# EAGLE design esquema v4 (EAGLE 9.6.2)
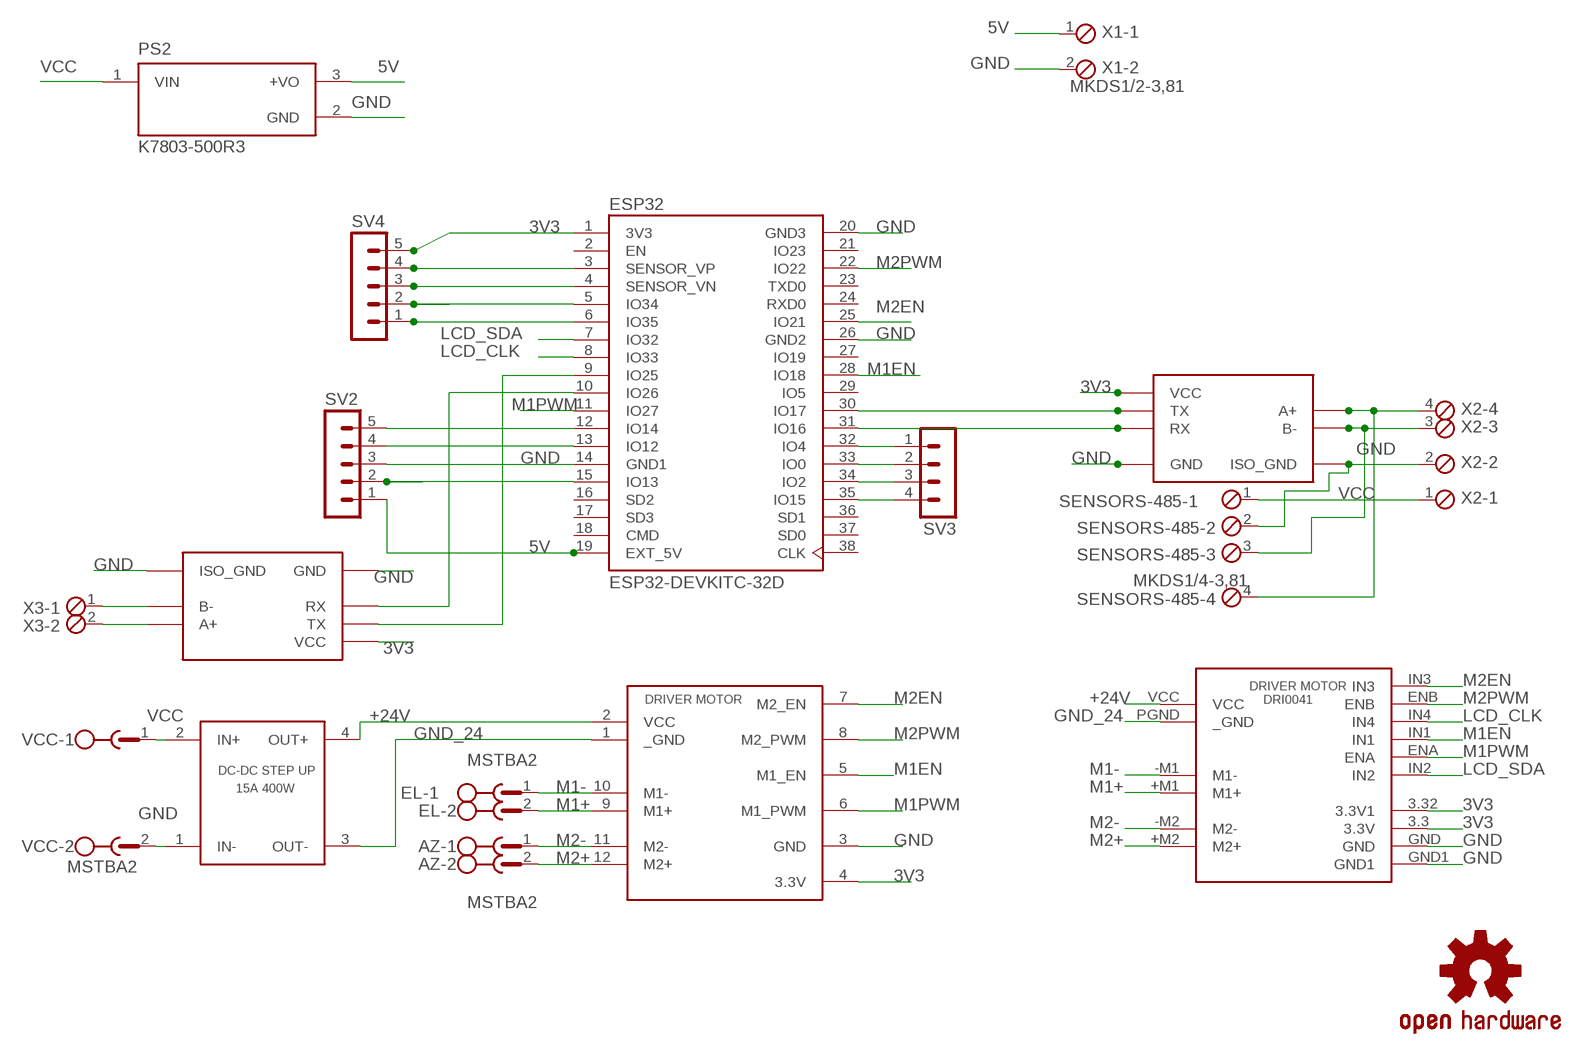
[diagram p0: schematic, sheet 1]

## Parts
AZ  MSTBA2  [MSTBA2]
EL  MSTBA2  [MSTBA2]
ESP32  ESP32-DEVKITC-32D  [MODULE_ESP32-DEVKITC-32D]
LOGO1  OSHW-LOGOMINI  [OSHW-LOGO-MINI]
M1  DRIVER_MOTOR  [DRIVER_MOTOR]
M2  DC-DC_STRP_UP  [DC-DC-SETP-UP]
M3  LIMNOTECH_SMC_RS485  [LIMNOTECH_SMC_RS485]
M4  LIMNOTECH_SMC_RS485  [LIMNOTECH_SMC_RS485]
PS2  K7803-500R3  [CONV_K7803-500R3]
SENSORS-485  MKDS1/4-3,81  [4POL381]
SV2  MA05-1  [MA05-1]
SV3  MA04-1  [MA04-1]
SV4  MA05-1  [MA05-1]
U$2  DRIVER_DRI0041  [DRI0041]
VCC  MSTBA2  [MSTBA2]
X1  MKDS1/2-3,81  [2POL381]
X2  MKDS1/4-3,81  [4POL381]
X3  MKDS1/2-3,81  [2POL381]

## Nets
3V3: ESP32.1(3V3) M1.4(3.3V) M3.VCC M4.VCC SV4.5 U$2.3.3(3.3V) U$2.3.32(3.3V1)
5V: ESP32.19(EXT_5V) PS2.3(+VO) SV2.1 X1.1
+24V: M1.2(VCC) M2.4(OUT+) U$2.VCC
GND: ESP32.14(GND1) ESP32.20(GND3) ESP32.26(GND2) M1.3(GND) M2.1(IN-) M3.GND M3.GND_ISO(ISO_GND) M4.GND M4.GND_ISO(ISO_GND) PS2.2(GND) SENSORS-485.2 SV2.3 U$2.GND U$2.GND1 VCC.2 X1.2 X2.2
GND_24: M1.1(_GND) M2.3(OUT-) U$2.PGND(_GND)
LCD_CLK: ESP32.8(IO33) U$2.IN4
LCD_SDA: ESP32.7(IO32) U$2.IN2
M1+: EL.2 M1.9(M1+) U$2.+M1(M1+)
M1-: EL.1 M1.10(M1-) U$2.-M1(M1-)
M1EN: ESP32.28(IO18) M1.5(M1_EN) U$2.IN1
M1PWM: ESP32.11(IO27) M1.6(M1_PWM) U$2.ENA
M2+: AZ.2 M1.12(M2+) U$2.+M2(M2+)
M2-: AZ.1 M1.11(M2-) U$2.-M2(M2-)
M2EN: ESP32.25(IO21) M1.7(M2_EN) U$2.IN3
M2PWM: ESP32.22(IO22) M1.8(M2_PWM) U$2.ENB
N$1: M4.B- SENSORS-485.3 X2.3
N$2: M4.A+ SENSORS-485.4 X2.4
N$3: ESP32.3(SENSOR_VP) SV4.4
N$4: ESP32.4(SENSOR_VN) SV4.3
N$5: ESP32.10(IO26) M3.RX
N$6: ESP32.9(IO25) M3.TX
N$7: ESP32.31(IO16) M4.RX
N$8: ESP32.30(IO17) M4.TX
N$9: M3.B- X3.1
N$10: M3.A+ X3.2
N$11: ESP32.5(IO34) SV4.2
N$12: ESP32.6(IO35) SV4.1
N$13: ESP32.15(IO13) SV2.2
N$18: ESP32.13(IO12) SV2.4
N$19: ESP32.12(IO14) SV2.5
N$20: ESP32.32(IO4) SV3.1
N$21: ESP32.33(IO0) SV3.2
N$22: ESP32.34(IO2) SV3.3
N$23: ESP32.35(IO15) SV3.4
VCC [power]: M2.2(IN+) PS2.1(VIN) SENSORS-485.1 VCC.1 X2.1
Unconnected: ESP32.2(EN) ESP32.16(SD2) ESP32.17(SD3) ESP32.18(CMD) ESP32.21(IO23) ESP32.23(TXD0) ESP32.24(RXD0) ESP32.27(IO19) ESP32.29(IO5) ESP32.36(SD1) ESP32.37(SD0) ESP32.38(CLK)

## Library data of the parts
AZ EL VCC = con-phoenix-508:MSTBA2: PHOENIX; MF: FARNELL; MPN: 1757242; OC_FARNELL: 3705171; OC_NEWARK: 71C4161
ESP32 = ESP32-DEVKITC-32D:ESP32-DEVKITC-32D: Eval Board For Esp-Wroom-32 Check prices <https://pricing.snapeda.com/parts/ESP32-DEVKITC-32D/Espressif%20Systems/view-part?ref=eda>; AVAILABILITY: Warning; DESCRIPTION: EVAL BOARD FOR ESP-WROOM-32; MF: Espressif Systems; MP: ESP32-DEVKITC-32D; PACKAGE: None; PRICE: None; PURCHASE-URL: https://pricing.snapeda.com/search/part/ESP32-DEVKITC-32D/?ref=eda
LOGO1 = SparkFun-Aesthetics:OSHW-LOGO: Open-Source Hardware (OSHW) Logo This logo indicates the piece of hardware it is found on incorporates a OSHW license and/or adheres to the definition of open source hardware found here: http://freedomdefined.org/OSHW
M1 = aamilibreria:DRIVER_MOTOR
M2 = aamilibreria:DC-DC_STRP_UP
M3 M4 = aamilibreria:LIMNOTECH_SMC_RS485: Layout for connecting SMC RS-485 module Module <https://www.amazon.com/SMAKN%C2%AE-Adapter-Serial-Converter-Module/dp/B010723BCE>
PS2 = K7803-500R3:K7803-500R3: DC/DC Converter Check availability <https://pricing.snapeda.com/parts/K7803-500R3/Mornsun%20America%2C%20LLC/view-part?ref=eda>; AVAILABILITY: In Stock; DESCRIPTION: Non-Isolated PoL Module DC DC Converter 1 Output 3.3V, -3.3V - - - 500mA, 300mA 4.75V, 7V - 36V, 32V Input; MF: Mornsun America, LLC; MP: K7803-500R3; PACKAGE: SIP-3-3 MORNSUN; PRICE: None; PURCHASE-URL: https://pricing.snapeda.com/search/part/K7803-500R3/?ref=eda
SENSORS-485 X2 = con-phoenix-381:MKDS1/4-3,81: MKDS 1/4-3,81 - Order No. 1727036 Pitch: 3,81mm Number of terminals: 4 Rated Voltage: 160V Maximum load current/ cross section: 12A/1.5mm2-AWG16 Housing Interlocking: none Color: Green
SV2 SV4 = con-lstb:MA05-1: PIN HEADER; OC_FARNELL: unknown; OC_NEWARK: unknown
SV3 = con-lstb:MA04-1: PIN HEADER; OC_FARNELL: unknown; OC_NEWARK: unknown
U$2 = aamilibreria:DRIVER_DRI0041
X1 X3 = con-phoenix-381:MKDS1/2-3,81: MKDS 1/2-3,81 - Order No. 1727010 (RS-Online - 101-5384) Pitch: 3,81mm Number of terminals: 2 Rated Voltage: 160V Maximum load current/ cross section: 12A/1.5mm2-AWG16 Housing Interlocking: none Color: Green

## Net classes
0 default: width 0.5 mm, drill 0.5 mm, clearance 0.8 mm
1 power: width 0.8 mm, clearance 1 mm

## Board
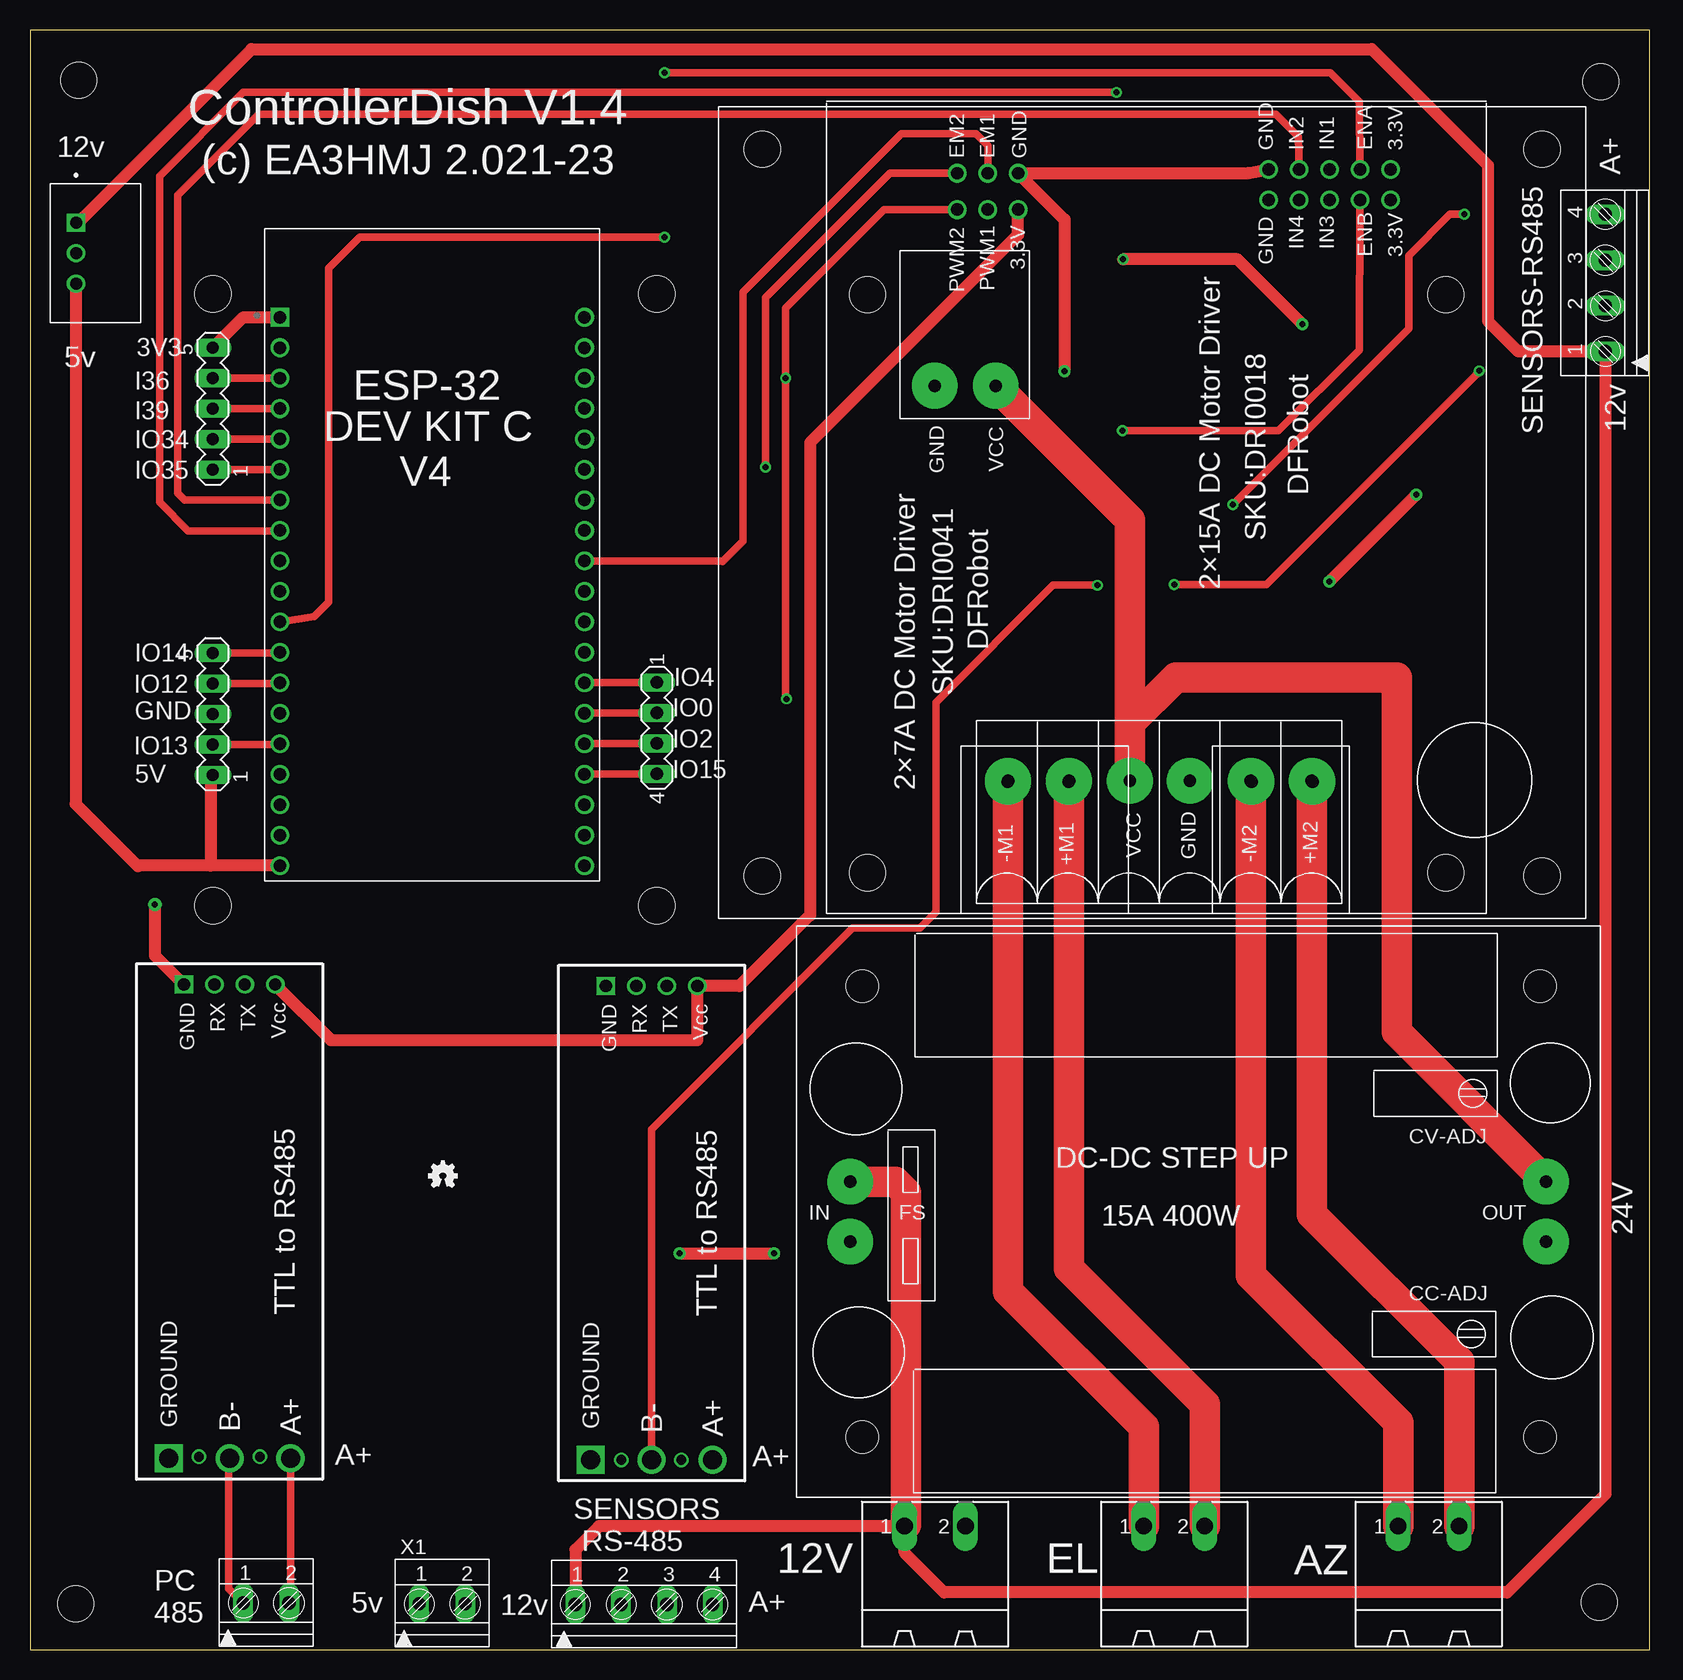
[diagram p1: board, top side]
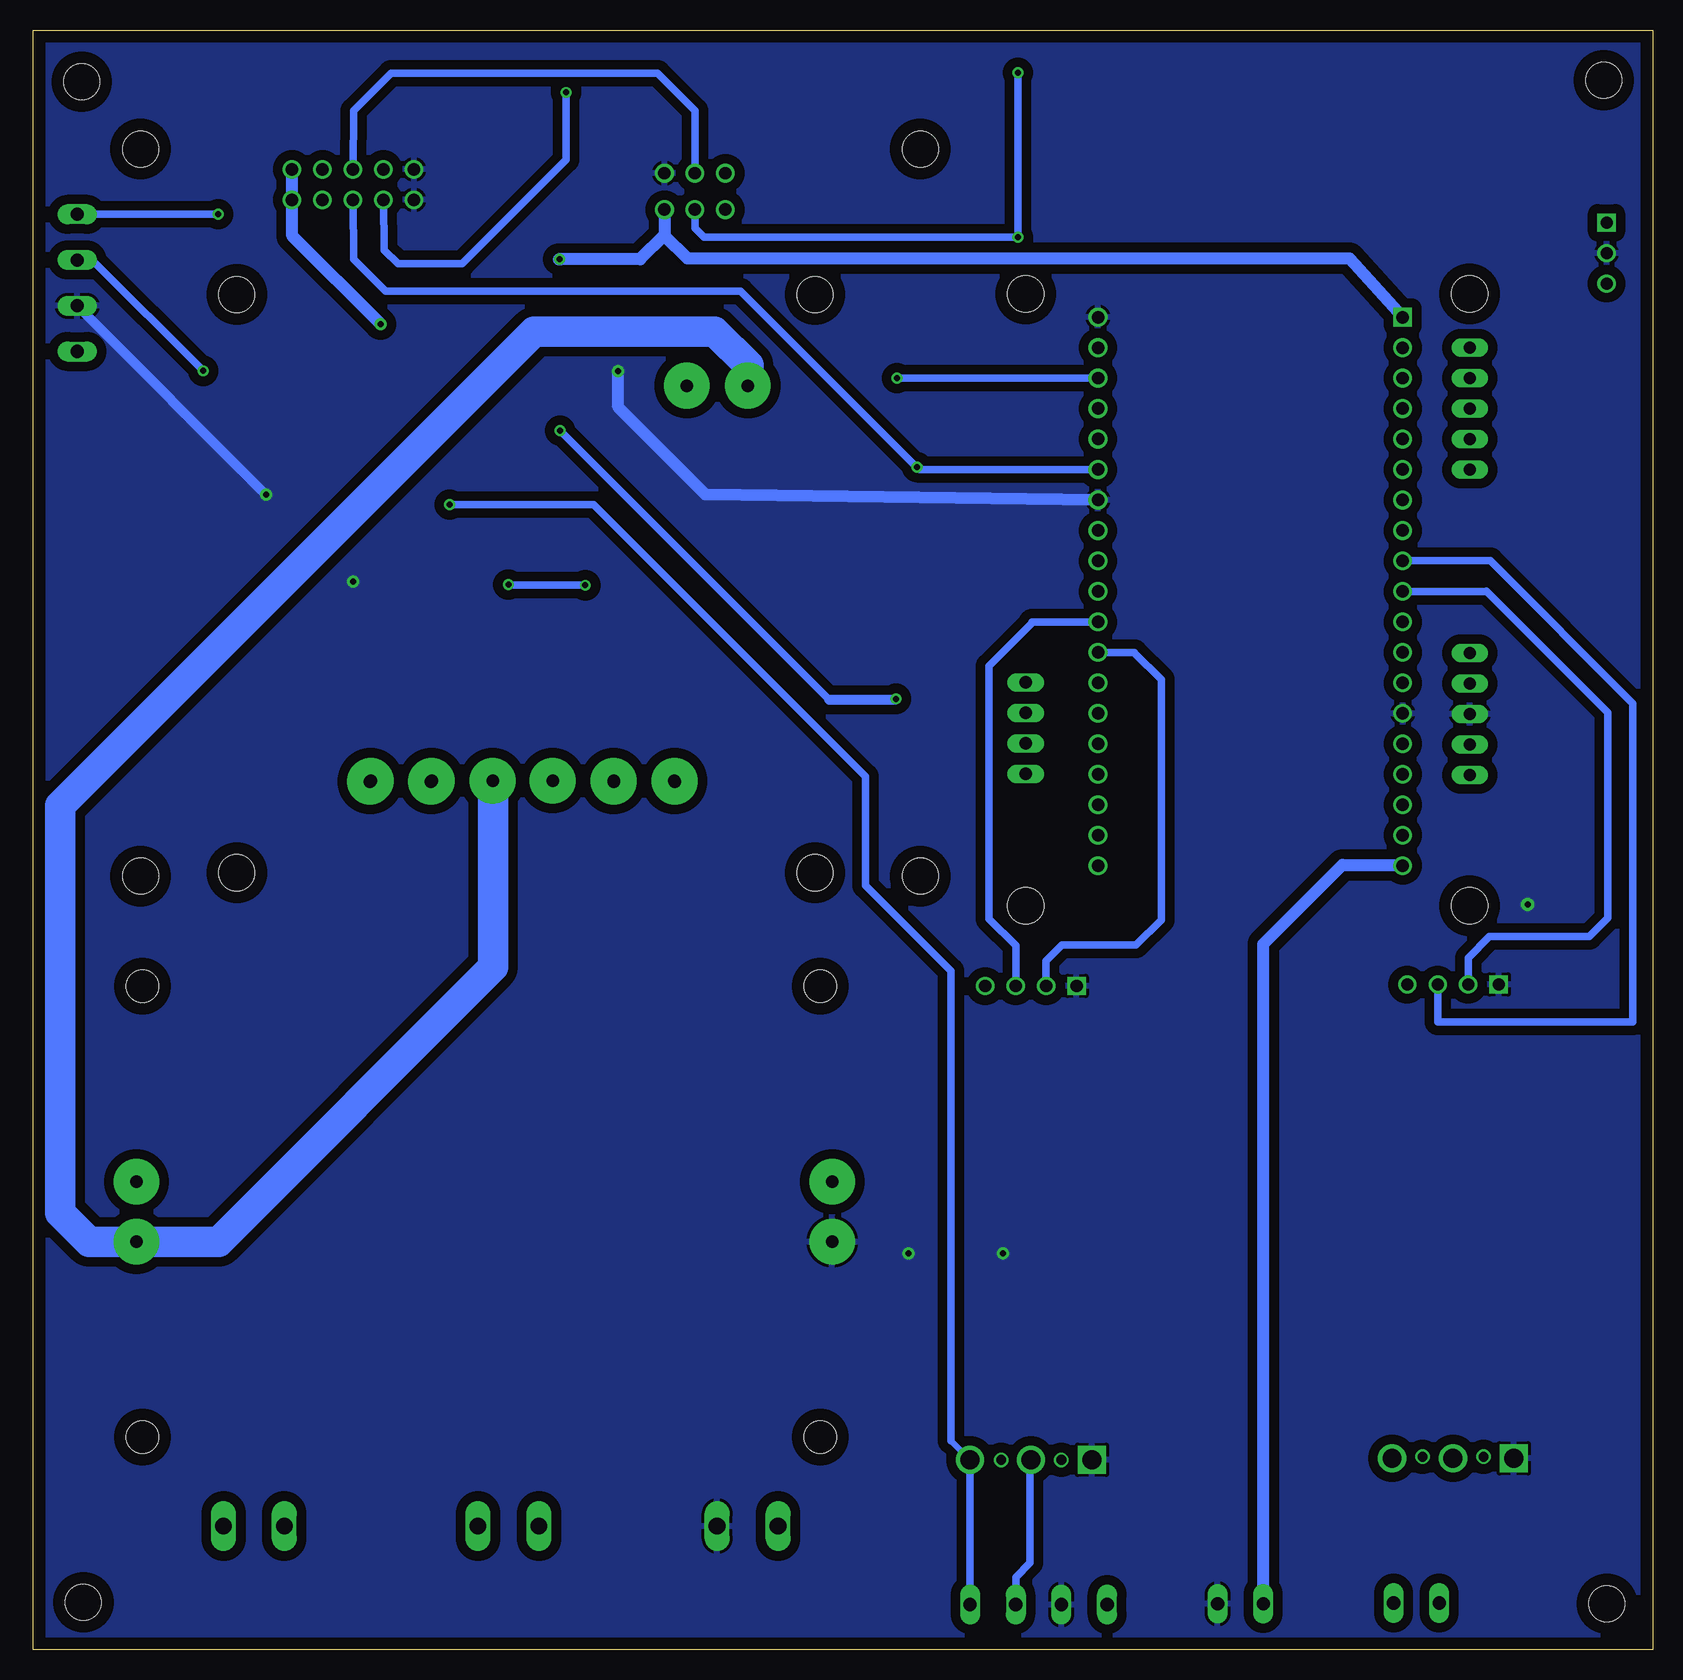
[diagram p2: board, bottom side, seen from below]

Size 135 x 135 mm. Coordinates in mm from the lower left corner, seen from the top.
Outline: 0,135 0,0 135,0 135,135 0,135
Copper layers (1*16): Top 0.035mm / dielectric 1.5mm / Bottom 0.035mm
Design rules "default": minimum track width 6mil, minimum drill 0.35mm, track to track 6mil, track to pad 6mil, pad to pad 6mil, via to via 6mil, smd to smd 6mil, copper to edge 40mil, drill to drill 6mil, minimum pad ring 10mil, minimum via ring 8mil, stop-mask expansion 4mil, vias tented up to drill 0mil, thermal gap 10mil
Holes 3 mm at 3.81,3.81 4.06,130.81 130.81,3.94 130.94,130.68 15.25,113 52.25,113 52.25,62 15.25,62

### Footprints (pad centres in the part's own frame; a part is rotated, then mirrored left to right if it is on the bottom)
MSTBA2 = drill 1.397 long: 1 -2.54,5.08; 2 2.54,5.08
MODULE_ESP32-DEVKITC-32D = drill 1.04 square: 1 -12.7,19.76 | drill 1.04: 2 -12.7,17.22; 3 -12.7,14.68; 4 -12.7,12.14; 5 -12.7,9.6; 6 -12.7,7.06; 7 -12.7,4.52; 8 -12.7,1.98; 9 -12.7,-0.56; 10 -12.7,-3.1; 11 -12.7,-5.64; 12 -12.7,-8.18; 13 -12.7,-10.72; 14 -12.7,-13.26; 15 -12.7,-15.8; 16 -12.7,-18.34; 17 -12.7,-20.88; 18 -12.7,-23.42; 19 -12.7,-25.96; 20 12.7,19.76; 21 12.7,17.22; 22 12.7,14.68; 23 12.7,12.14; 24 12.7,9.6; 25 12.7,7.06; 26 12.7,4.52; 27 12.7,1.98; 28 12.7,-0.56; 29 12.7,-3.1; 30 12.7,-5.64; 31 12.7,-8.18; 32 12.7,-10.72; 33 12.7,-13.26; 34 12.7,-15.8; 35 12.7,-18.34; 36 12.7,-20.88; 37 12.7,-23.42; 38 12.7,-25.96
DRIVER_MOTOR = drill 1.04 pad 3.81: 1 11.5,33; 2 11.5,38; 9 11.5,43.08; 10 11.5,48.16; 11 11.5,27.92; 12 11.5,22.84 | drill 1.04: 3 62.14,47.32; 4 59.1,47.32; 5 62.14,49.86; 6 59.1,49.86; 7 62.14,52.4; 8 59.1,52.4 | hole 3: 3.55,68.65; 64.15,68.65; 64.15,3.65; 3.55,3.65
DC-DC-SETP-UP = drill 1.04 pad 3.81: 1 4.5,21.3; 2 4.5,26.3; 3 62.5,21.3; 4 62.5,26.3 | hole 2.7: 5.5,5; 5.5,42.6; 62,42.6; 62,5
LIMNOTECH_SMC_RS485 = drill 1.57: A+ 19.75,5.08; B- 19.75,0 | drill 1.016 square: GND -19.75,-3.81 | drill 1.57 square: GND_ISO 19.75,-5.08 | drill 1.016: RX -19.75,-1.27; TX -19.75,1.27; VCC -19.75,3.81
CONV_K7803-500R3 = drill 1 square: 1 -2.54,-1.625 | drill 1: 2 0,-1.625; 3 2.54,-1.625
4POL381 = drill 1.1 long: 1 0,0; 2 3.81,0; 3 7.62,0; 4 11.43,0
MA05-1 = drill 1.016 long: 1 -5.08,0; 2 -2.54,0; 3 0,0; 4 2.54,0; 5 5.08,0
MA04-1 = drill 1.016 long: 1 -3.81,0; 2 -1.27,0; 3 1.27,0; 4 3.81,0
DRI0041 = drill 1.04: 3.3 62.032,8; 3.32 59.492,8; ENA 62.032,10.54; ENB 59.492,10.54; GND 62.032,18.16; GND1 59.492,18.16; IN1 62.032,13.08; IN2 62.032,15.62; IN3 59.492,13.08; IN4 59.492,15.62 | drill 1.04 pad 3.81: +M1 11,34.82; +M2 11,14.5; -M1 11,39.9; -M2 11,19.58; PGND 44,46; VCC 44,40.92 | hole 3: 3.4,51.6; 51.6,51.6; 51.6,3.4; 3.4,3.4
2POL381 = drill 1.1 long: 1 0,0; 2 3.81,0

### Placement (x,y rotation side)
AZ  116.59,5.21 0 top
EL  95.38,5.21 0 top
ESP32  33.53,91.3 0 top
LOGO1  34.42,39.5 0 top
M1  129.69,60.92 90 top
M2  63.88,12.7 0 top
M3  16.64,35.69 270 top
M4  51.82,35.56 270 top
PS2  5.46,116.4 270 top
SENSORS-485  131.32,108.2 90 top
SV2  15.24,77.98 90 top
SV3  52.25,76.81 270 top
SV4  15.24,103.44 90 top
U$2  121.41,61.35 90 top
VCC  75.44,5.21 0 top
X1  32.45,3.81 0 top
X2  45.47,3.75 0 top
X3  17.78,3.87 0 top

### Tracks (layer width: path | path; a pad name or v marks a point on that pad's centre or on a via)
3V3  (via drill 0.5, 0.5 pad 1)
  Top 1.016: M3.VCC 25.08,50.8 55.63,50.8 M4.VCC 59.12,55.31 65.02,61.21 65.02,100.58 82.37,117.93 M1.4 | v106.05,110.49 100.65,115.89 v91.12,115.89 | SV4.5 17.78,111.06 ESP32.1
  Bottom 0.5: v91.12,115.89 91,116.03 91,115.89
  Bottom 1.016: v106.05,110.49 113.38,117.83 U$2.3.32 U$2.3.3 | ESP32.1 25.27,115.96 80.46,115.96 82.37,117.86 M1.4 82.37,117.91 84.39,115.89 91,115.89 v91.12,115.89 91.19,115.89
5V
  Top 1.016: ESP32.19 15.05,65.34 | 15.05,65.34 9.01,65.34 9.01,65.29 3.81,70.48 3.81,113.83 PS2.3 | SV2.1 15.05,72.71 15.05,65.34
  Bottom 1.016: X1.1 32.45,58.8 25.84,65.41 20.84,65.41 ESP32.19
+24V
  Top 2.54: M2.4 113.92,51.46 113.92,81.03 95.5,81.03 91.69,77.21 M1.2 91.69,94.15 U$2.VCC
GND  (via drill 0.5 pad 1, 0.5 pad 1.1, 0.8 pad 2)
  Top 1.016: v54.17,33.02 v62.04,33.02 | U$2.GND 101.54,123.06 M1.3 86.23,119.2 v86.23,106.55 | v115.57,96.27 v108.33,89.03 | M3.GND 10.41,57.85 v10.41,62.1
  Bottom 0.813: SENSORS-485.2 115.63,96.33 115.63,96.27 v115.57,96.27
  Bottom 1.016: ESP32.26 78.94,96.28 86.23,103.57 v86.23,106.55
  other vias: 11.49,15.94 46.74,15.81
  pour Bottom: -1.27,141.35 140.21,141.35 140.21,0.13 -1.27,0.13
GND_24
  Bottom 2.54: M1.1 96.65,72.38 96.65,56.9 119.54,34 M2.3 130.33,34 132.71,36.38 132.71,70.36 93.22,109.86 78.17,109.86 75.38,107.06 75.38,105.12 75.35,105.14 U$2.PGND
LCD_CLK  (via drill 0.5 pad 0.85)
  Top 0.61: v90.55,129.79 17.79,129.79 10.79,122.8 10.79,95.63 13.2,93.23 20.78,93.23 ESP32.8
  Bottom 0.61: v90.55,129.79 90.55,124.21 99.25,115.51 104.58,115.51 105.73,116.65 U$2.IN4
LCD_SDA
  Top 0.61: U$2.IN2 105.73,126.11 103.86,127.98 19.08,127.98 12.31,121.21 12.31,96.4 12.88,95.83 13.11,95.82 ESP32.7
M1+
  Top 0.5: U$2.+M1 86.78,72.47 M1.9
  Top 0.61: M1.9 86.49,72.54 86.49,73.03 86.61,72.91 M1.9
  Top 2.54: M1.9 86.61,31.76 97.92,20.45 EL.2
M1-
  Top 0.61: M1.10 81.52,72.41 U$2.-M1
  Top 2.54: M1.10 81.53,29.85 92.84,18.54 EL.1
M1EN
  Top 0.61: 79.85,123.09 79.85,125.37 78.86,126.36 72.64,126.36 59.44,113.16 59.44,92.39 57.73,90.69 57.73,90.74 ESP32.28
  Top 0.813: M1.5 79.85,123.09
  Bottom 0.61: U$2.IN1 108.27,128.27 105.16,131.38 82.93,131.38 79.82,128.27 M1.5
  Bottom 0.813: M1.5
M1PWM  (via drill 0.5 pad 0.6, 0.5 pad 0.8)
  Top 0.61: U$2.ENA 110.81,129.03 108.39,131.44 v52.9,131.44 | ESP32.11 23.7,86.12 24.89,87.31 24.89,115.13 27.5,117.73 v52.9,117.73
  Bottom 0.61: M1.6 79.83,118.5 79.06,117.73 v52.9,117.73 v52.9,131.44 52.9,131.51
M2+
  Top 0.5: U$2.+M2 106.92,72.47 M1.12
  Top 0.61: 107.45,73.03 M1.12 107.73,72.42
  Top 2.54: M1.12 106.85,36.28 119.13,24 AZ.2
M2-
  Top 0.5: U$2.-M2 101.72,72.47 M1.11
  Top 0.61: M1.11 101.77,73.25 101.92,73.41 101.92,72.57 M1.11
  Top 2.54: M1.11 101.77,31.2 114.05,18.92 AZ.1
M2EN  (via drill 0.5)
  Top 0.61: M1.7 71.69,123.06 61.31,112.68 v61.31,98.55
  Bottom 0.61: U$2.IN3 108.27,115.89 105.6,113.22 76.01,113.22 61.19,98.4 61.19,98.42 v61.31,98.55 61.12,98.36 ESP32.25
  Bottom 0.813: v61.31,98.55 61.21,98.55
M2PWM  (via drill 0.5, 0.5 pad 0.8)
  Top 0.61: M1.8 71.19,120.02 63,111.83 v63,105.98 63,79.31 v63.06,79.25 | U$2.ENB 110.81,108.33 104.08,101.6 v91.06,101.6
  Bottom 0.61: v91.06,101.6 68.64,79.18 | v63,105.98 ESP32.22
  Bottom 0.813: 68.64,79.18 63.12,79.18 v63.06,79.24 v63.06,79.25
N$1  (via drill 0.5, 0.85 pad 2)
  Top 0.61: M4.B- 51.82,43.37 68.58,60.13 74.17,60.13 75.5,61.47 75.5,78.93 85.28,88.71 v88.96,88.71 | v95.38,88.77 103.06,88.77 120.84,106.55 v120.81,106.58
  Bottom 0.61: M4.B- 51.88,15.75 51.88,7.24 53.09,6.03 X2.3 | v88.96,88.71 95.31,88.71 v95.38,88.77 | v120.81,106.58 130.05,115.82 SENSORS-485.3
  other vias: 51.82,15.81
N$2  (via drill 0.5, 0.85 pad 2)
  Top 0.5: M4.A+ 56.88,15.93 M4.A+
  Top 0.61: v100.27,95.44 114.94,110.11 114.94,116.2 118.36,119.63 v119.57,119.63
  Bottom 0.5: M4.A+ 58.48,17.4
  Bottom 0.61: 58.48,17.4 58.48,56.58 65.6,63.69 65.6,72.77 88.27,95.44 v100.27,95.44 | M4.A+ X2.4 | v119.57,119.63 SENSORS-485.4
  other vias: 56.9,15.81
N$3
  Top 0.61: ESP32.3 20.81,106 20.79,105.98 SV4.4
N$4
  Top 0.5: SV4.3 15.28,103.67 15.28,103.44
  Top 0.61: ESP32.4 15.28,103.44 15.27,103.44
N$5
  Bottom 0.61: ESP32.10 14.04,88.2 13.85,88.21 3.75,78.11 3.75,60.96 5.27,59.44 13.59,59.44 15.37,57.66 M3.RX
N$6
  Bottom 0.61: M3.TX 17.91,52.32 1.65,52.32 1.65,78.87 13.54,90.75 20.82,90.75 ESP32.9
N$7
  Bottom 0.61: M4.RX 50.55,57.4 49.21,58.74 43.05,58.74 40.96,60.83 40.96,80.83 43.19,83.07 43.2,83.12 ESP32.31
N$8
  Bottom 0.61: ESP32.30 51.73,85.66 51.74,85.55 55.31,81.98 55.31,60.9 53.09,58.67 M4.TX
N$9  (via drill 0.8 pad 2)
  Top 0.5: M3.B- 16.9,15.93 M3.B-
  Top 0.61: M3.B- 16.57,15.87 16.57,5.08 X3.1
  other vias: 16.64,15.94
N$10  (via drill 0.8 pad 2)
  Top 0.5: M3.A+ 21.77,15.93 M3.A+
  Top 0.61: M3.A+ 21.72,4 X3.2
  other vias: 21.72,15.94
N$11
  Top 0.5: SV4.2 15.28,101.08 15.28,100.9
  Top 0.61: ESP32.5 15.28,100.9 15.27,100.9
N$12
  Top 0.5: SV4.1 15.28,98.47 15.28,98.36
  Top 0.61: ESP32.6 15.28,98.36 15.27,98.36
N$13
  Top 0.61: SV2.2 20.77,75.44 ESP32.15
N$14  (via drill 0.8)
  other vias: 19.18,16.07
N$15  (via drill 0.8)
  other vias: 14.1,16.07
N$16  (via drill 0.8)
  other vias: 49.28,15.81
N$17  (via drill 0.8)
  other vias: 54.29,15.81
N$18
  Top 0.61: SV2.4 20.77,80.52 ESP32.13
N$19
  Top 0.61: SV2.5 20.77,83.06 ESP32.12
N$20
  Top 0.61: SV3.1 46.27,80.62 ESP32.32
N$21
  Top 0.61: ESP32.33 46.27,78.08 SV3.2
N$22
  Top 0.61: SV3.3 46.27,75.54 ESP32.34
N$23
  Top 0.61: ESP32.35 52.21,72.96 SV3.4
VCC
  Top 0.813: VCC.1 73.03,10.41
  Top 1: 47.43,10.29 45.47,8.32 X2.1
  Top 1.016: PS2.1 4,118.94 18.48,133.41 111.83,133.41 121.54,123.71 121.54,110.74 124.08,108.2 SENSORS-485.1 131.32,12.95 123.13,4.76 76.2,4.76 72.9,8.06 VCC.1 47.43,10.29
  Top 2.54: 73.03,10.41 73.03,38.1 72.12,39 M2.2

### Text on the board
tNames: ControllerDish V1.4 | 12v | (c) EA3HMJ 2.021-23 | A+ | 3V3 | 5v | I36 | I39 | DEV KIT C | SENSORS-RS485 | 12v | IO34 | ESP-32 | IO35 | V4 | IO14 | IO12 | IO4 | GND | IO0 | IO13 | IO2 | IO15 | 5V | 24V | A+ | A+ | SENSORS / RS-485 | 12V | 5v | 12v | A+ | PC / 485